# EAGLE design ir_camera (EAGLE 7.7.0)
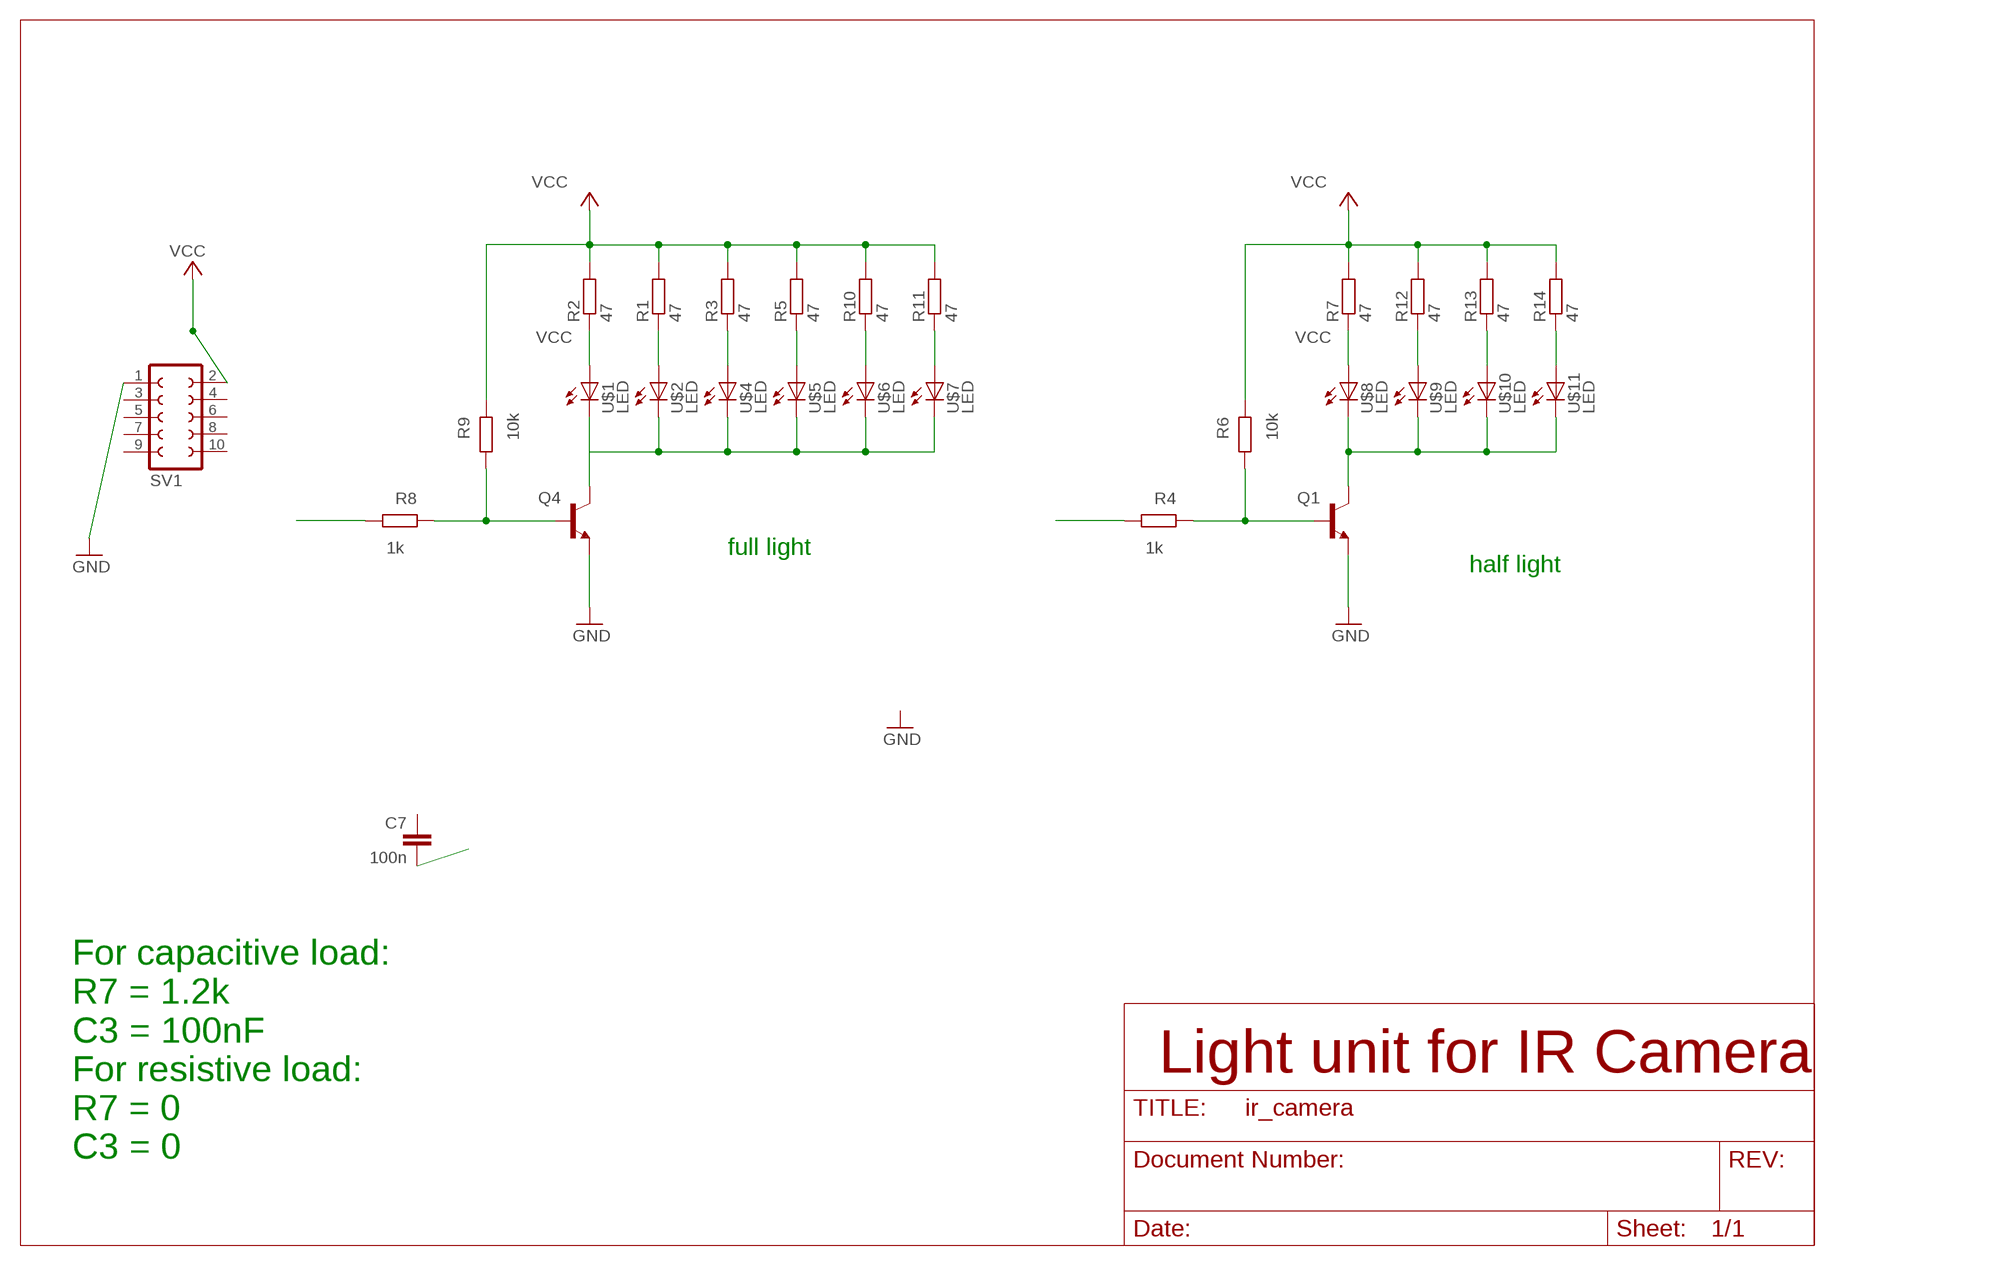
[diagram p0: schematic, sheet 1]

## Parts
C7  100n  C-55MM  [C050-024X044]
Q1  BC548  [TO92-EBC]
Q4  BC548  [TO92-EBC]
R1  47  R-EU_0207/2V  [R_0207/2V]
R2  47  R-EU_0207/2V  [R_0207/2V]
R3  47  R-EU_0207/2V  [R_0207/2V]
R4  1k  R-EU_0207/2V  [R_0207/2V]
R5  47  R-EU_0207/2V  [R_0207/2V]
R6  10k  R-EU_0207/2V  [R_0207/2V]
R7  47  R-EU_0207/2V  [R_0207/2V]
R8  1k  R-EU_0207/2V  [R_0207/2V]
R9  10k  R-EU_0207/2V  [R_0207/2V]
R10  47  R-EU_0207/2V  [R_0207/2V]
R11  47  R-EU_0207/2V  [R_0207/2V]
R12  47  R-EU_0207/2V  [R_0207/2V]
R13  47  R-EU_0207/2V  [R_0207/2V]
R14  47  R-EU_0207/2V  [R_0207/2V]
SV1  FE05-2  [FE05-2]
U$1  LED  [LED_LD260]
U$2  LED  [LED_LD260]
U$4  LED  [LED_LD260]
U$5  LED  [LED_LD260]
U$6  LED  [LED_LD260]
U$7  LED  [LED_LD260]
U$8  LED  [LED_LD260]
U$9  LED  [LED_LD260]
U$10  LED  [LED_LD260]
U$11  LED  [LED_LD260]

## Nets
GND: Q1.E Q4.E SV1.1
N$3: R8.2
N$6: Q4.B R8.1 R9.1
N$8: R2.1 U$1.A
N$9: C7.2
N$10: R1.1 U$2.A
N$11: R3.1 U$4.A
N$12: R5.1 U$5.A
N$14: R10.1 U$6.A
N$15: R11.1 U$7.A
N$16: Q4.C U$1.K(C) U$2.K(C) U$4.K(C) U$5.K(C) U$6.K(C) U$7.K(C)
N$17: Q1.B R4.1 R6.1
N$18: R7.1 U$8.A
N$19: R12.1 U$9.A
N$20: R13.1 U$10.A
N$21: R14.1 U$11.A
N$24: Q1.C U$8.K(C) U$9.K(C) U$10.K(C) U$11.K(C)
N$25: R4.2
VCC: R1.2 R2.2 R3.2 R5.2 R6.2 R7.2 R9.2 R10.2 R11.2 R12.2 R13.2 R14.2 SV1.2
Unconnected: C7.1 SV1.3 SV1.4 SV1.5 SV1.6 SV1.7 SV1.8 SV1.9 SV1.10

## Notes on the sheet
- full light
- half light
- Light unit for IR Camera
- For capacitive load:
  R7 = 1.2k
  C3 = 100nF
  For resistive load: 
  R7 = 0
  C3 = 0

## Library data of the parts
C7 = bauteile_jbt:C-5: standard condensator
Q1 Q4 = bauteile_jbt:BC548*: NPN Transistor
R1-R14 = bauteile_jbt:R-EU_: RESISTOR, European symbol
SV1 = bauteile_jbt:FE05-2: FEMALE "Wannenbuchse"; OC_FARNELL: unknown; OC_NEWARK: unknown
U$1 U$2 U$4-U$11 = bauteile_jbt:LED

## Net classes
0 default: width 0.15 mm, drill 0.3 mm, clearance 0.205 mm

## Board
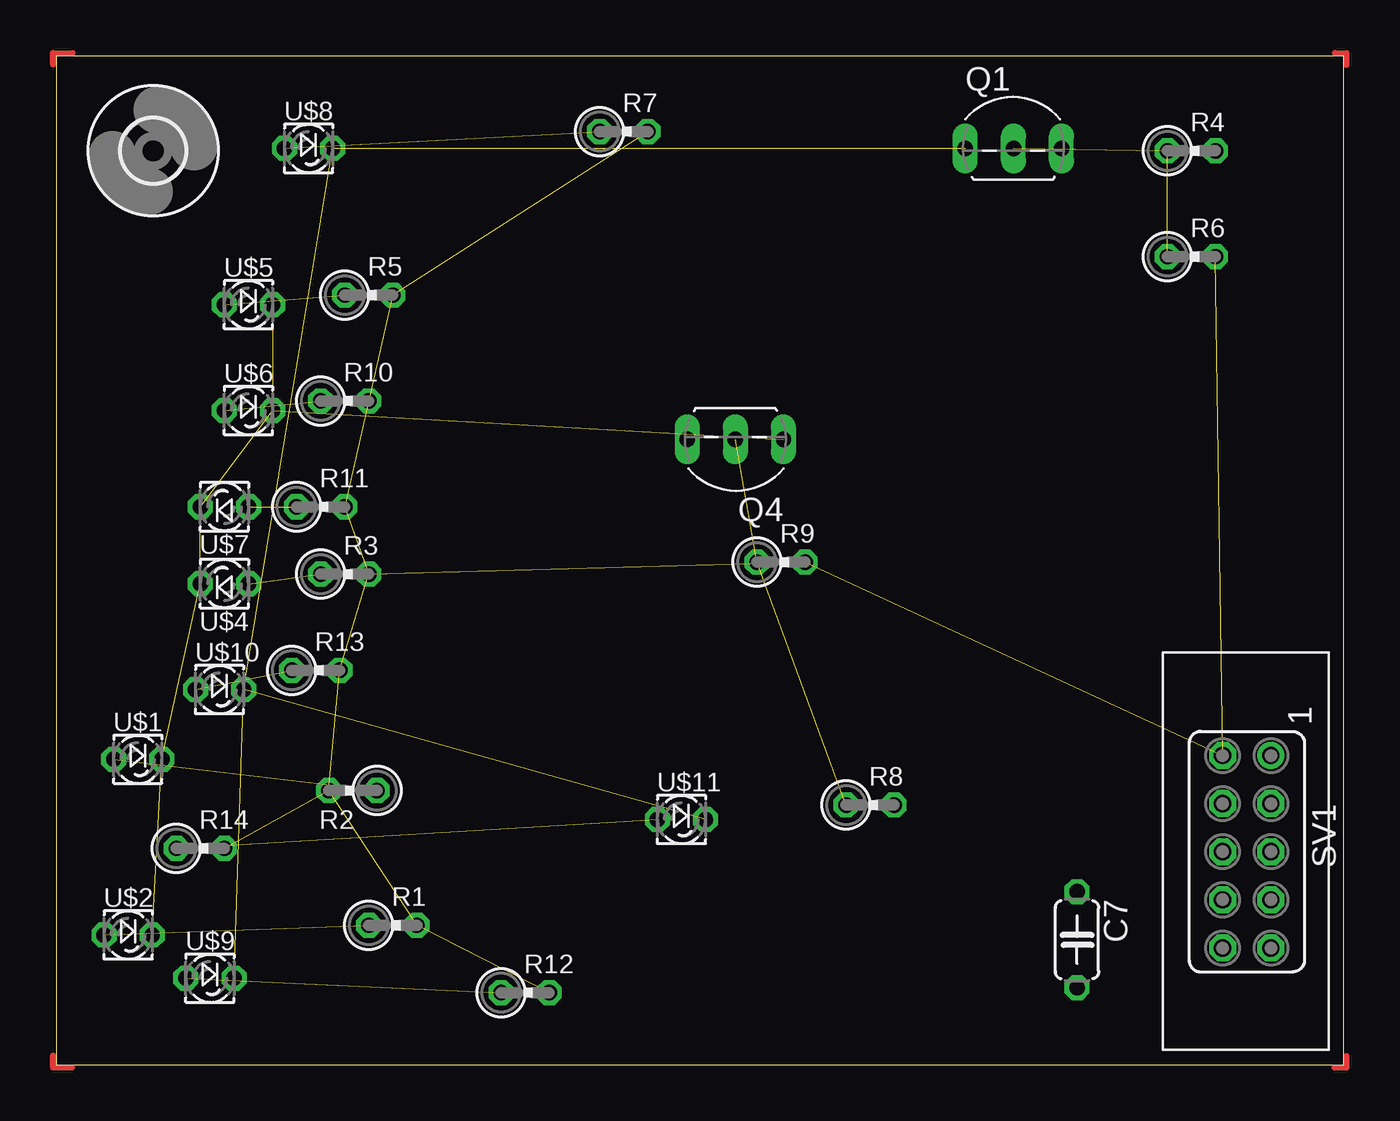
[diagram p1: board, top side]
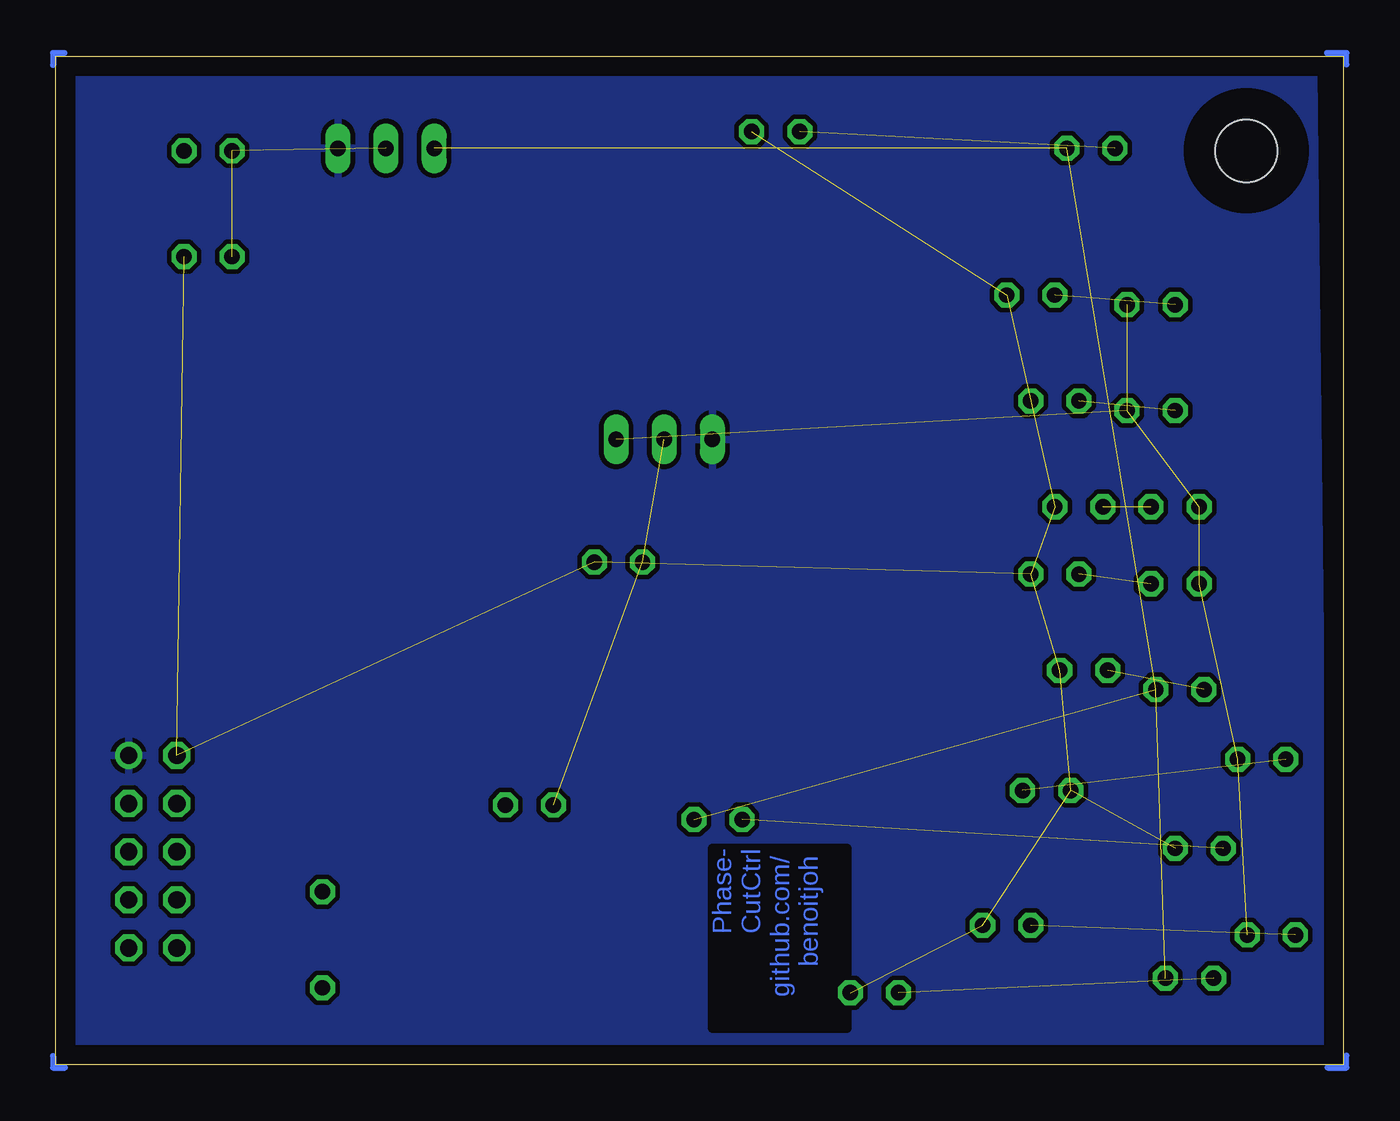
[diagram p2: board, bottom side, seen from below]

Size 67.98 x 53.26 mm. Coordinates in mm from the lower left corner, seen from the top.
Outline: 0,0 67.98,0 67.98,53.26 0,53.26 0,0
Copper layers (1*16): Top 0.035mm / dielectric 1.5mm / Bottom 0.035mm
Design rules "default": minimum track width 10mil, minimum drill 24mil, track to track 8mil, track to pad 8mil, pad to pad 8mil, via to via 8mil, smd to smd 8mil, copper to edge 40mil, drill to drill 8mil, minimum pad ring 10mil, minimum via ring 8mil, stop-mask expansion 4mil, vias tented up to drill 0mil, thermal gap 10mil

### Footprints (pad centres in the part's own frame; a part is rotated, then mirrored left to right if it is on the bottom)
C050-024X044 = drill 0.813 octagon: 1 -2.54,0; 2 2.54,0
TO92-EBC = drill 0.813 long: B 0,-1.27; C -2.54,-1.27; E 2.54,-1.27
R_0207/2V = drill 0.813 octagon: 1 -1.27,0; 2 1.27,0
FE05-2 = drill 0.914: 1 -5.08,1.27 | drill 0.914 octagon: 2 -5.08,-1.27; 3 -2.54,1.27; 4 -2.54,-1.27; 5 0,1.27; 6 0,-1.27; 7 2.54,1.27; 8 2.54,-1.27; 9 5.08,1.27; 10 5.08,-1.27
LED_LD260 = drill 0.813 octagon: A -1.27,0; K 1.27,0
3,3 = hole 3.3: 0,0

### Placement (x,y rotation side)
C7  53.9,6.6 270 top
Q1  50.55,49.66 0 top
Q4  35.86,31.75 180 top
R1  17.78,7.37 0 top
R2  15.67,14.48 180 top
R3  15.24,25.91 0 top
R4  59.94,48.26 0 top
R5  16.51,40.64 0 top
R6  59.94,42.67 0 top
R7  29.97,49.28 0 top
R8  42.98,13.72 0 top
R9  38.28,26.54 0 top
R10  15.24,35.05 0 top
R11  13.97,29.46 0 top
R12  24.77,3.81 0 top
R13  13.72,20.83 0 top
R14  7.62,11.43 0 top
SV1  62.87,11.25 270 top
U$1  4.32,16.13 0 top
U$2  3.81,6.86 0 top
U$3  [3,3]  5.13,48.26 0 top
U$4  8.89,25.4 180 top
U$5  10.16,40.13 0 top
U$6  10.16,34.54 0 top
U$7  8.89,29.46 180 top
U$8  13.34,48.39 0 top
U$9  8.13,4.57 0 top
U$10  8.64,19.81 0 top
U$11  33.02,12.95 0 top

### Tracks (layer width: path | path; a pad name or v marks a point on that pad's centre or on a via)
GND
  pour Bottom (isolate 0.254): 1.57,52.45 67.11,52.58 67.11,1.02 1.07,1.02 1.07,9.02
N$1
  Top 0.305: 67.51,53.42 68.12,53.42 68.12,52.78
N$2
  Bottom 0.305: 67.51,53.42 68.12,53.42 68.12,52.78
N$4
  Top 0.305: 68.12,0.46 68.12,-0.15 67.49,-0.15
N$5
  Bottom 0.305: 68.12,0.46 68.12,-0.15 67.49,-0.15
N$6  (2 unrouted)
N$7
  Top 0.305: 0.84,-0.15 -0.15,-0.15 -0.15,0.48
N$8  (1 unrouted)
N$10  (1 unrouted)
N$11  (1 unrouted)
N$12  (1 unrouted)
N$13
  Bottom 0.305: 0.84,-0.15 -0.15,-0.15 -0.15,0.48
N$14  (1 unrouted)
N$15  (1 unrouted)
N$16  (6 unrouted)
N$17  (2 unrouted)
N$18  (1 unrouted)
N$19  (1 unrouted)
N$20  (1 unrouted)
N$21  (1 unrouted)
N$24  (4 unrouted)
N$203
  Top 0.305: -0.15,52.81 -0.15,53.42 0.86,53.42
N$205
  Bottom 0.305: -0.15,52.81 -0.15,53.42 0.86,53.42
VCC  (12 unrouted)

### Text on the board
Bottom: Phase- / CutCtrl / github.com/ / benoitjoh
tValues: R1 | C1
bValues: AC in / L N | for resistive load: / no C1, R1=0 | GND | p0 | pcc | out / L N | VCC